# Altium schematic sheet ESP32W_Zzed.SchDoc
size A4
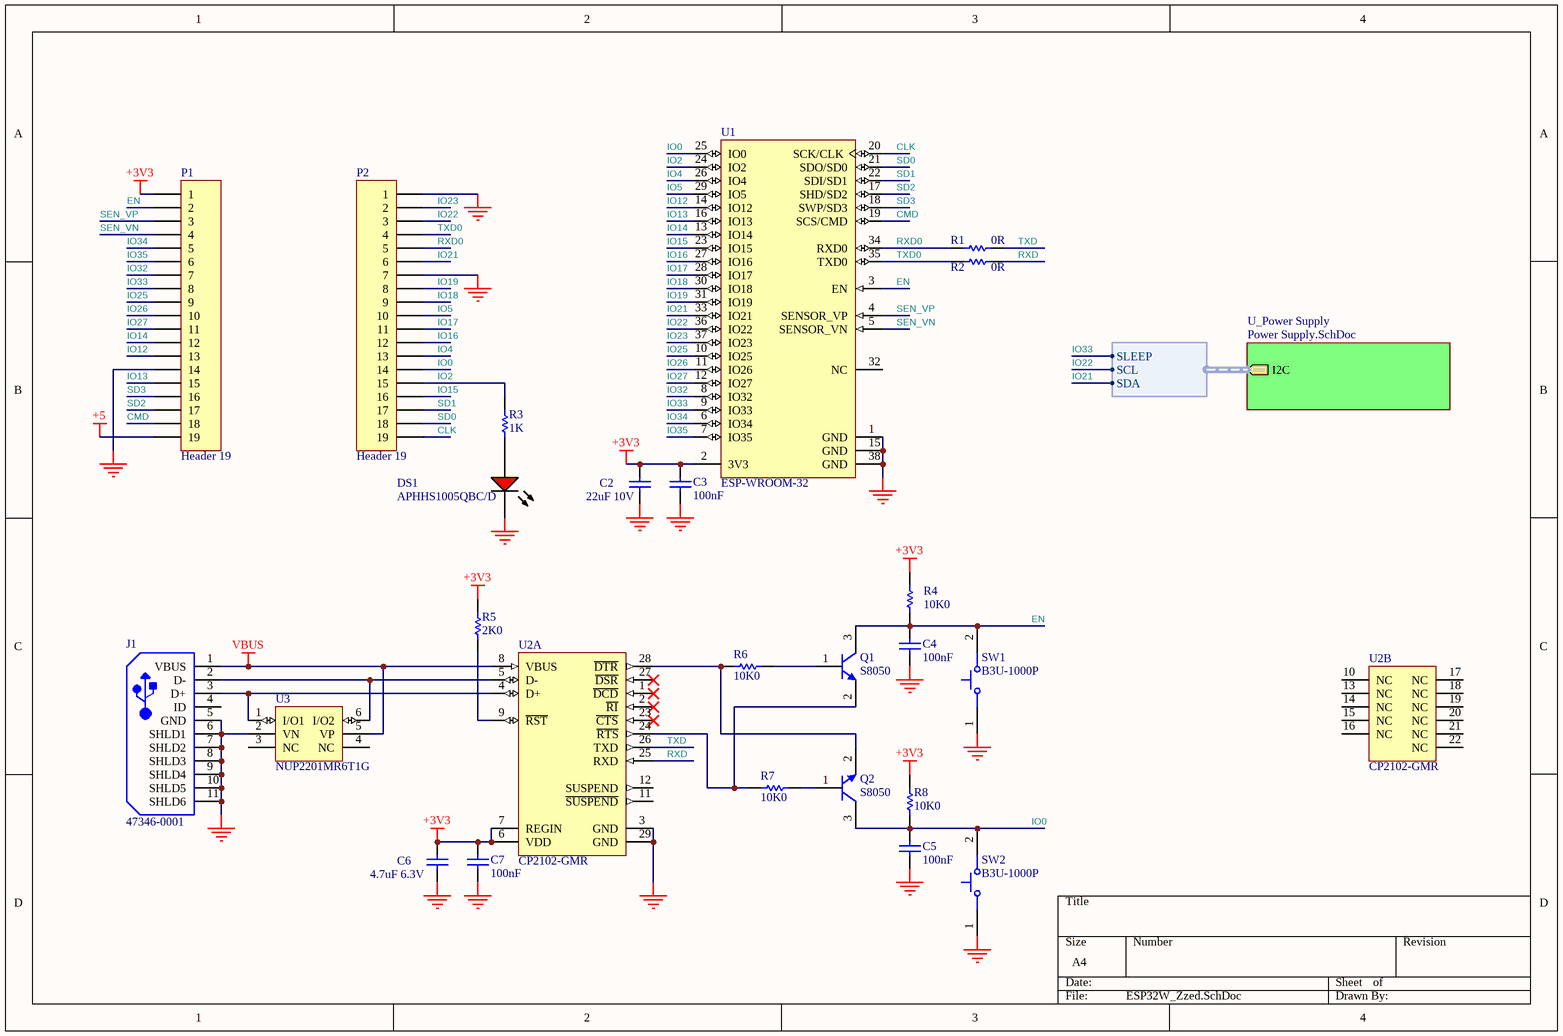
[diagram p0: ESP32W_Zzed.SchDoc]

## Parts
C2  22uF 10V  [CAPC0805(2012)145_L]
C3  100nF  [CAPC0402(1005)60_L]
C4  100nF  [CAPC0402(1005)60_L]
C5  100nF  [CAPC0402(1005)60_L]
C6  4.7uF 6.3V  [CAPC0402(1005)60_L]
C7  100nF  [CAPC0402(1005)60_L]
DS1  APHHS1005QBC/D  [KING-0402_V]
J1  47346-0001  [MOLX-47346-0001-5_V]
P1  Header 19  [HDR1X19]
P2  Header 19  [HDR1X19]
Q1  S8050  [KOCN-SOT23-3_L]
Q2  S8050  [KOCN-SOT23-3_L]
R1  0R  [RESC0402(1005)_L]
R2  0R  [RESC0402(1005)_L]
R3  1K  [RESC0402(1005)_L]
R4  10K0  [RESC0402(1005)_L]
R5  2K0  [RESC0402(1005)_L]
R6  10K0  [RESC0402(1005)_L]
R7  10K0  [RESC0402(1005)_L]
R8  10K0  [RESC0402(1005)_L]
SW1  B3U-1000P  [OMRON-B3U-1000_V]
SW2  B3U-1000P  [OMRON-B3U-1000_V]
U1  ESP-WROOM-32  [OLMX-ESP-WROOM-32]
U2  CP2102-GMR  [SLAB-QFN-28-3125x3125TP_N]  (parts A,B of 2)
U3  NUP2201MR6T1G  [ONSC-TSOP-6_V]

## Sub-sheets
U_Power Supply = Power Supply.SchDoc: I2C (out, harness I2C)

## Harnesses
I2C: SLEEP, SCL, SDA

## Nets
+3V3: C2.2 C3.2 C6.2 C7.2 P1.1 R4.2 R5.2 R8.1 U1.2(3V3) U2.6(VDD) U2.7(REGIN)
+5: P1.19
GND: C2.1 C3.1 C4.1 C5.1 C6.1 C7.1 DS1.2(K) J1.5(GND) J1.6(SHLD1) J1.7(SHLD2) J1.8(SHLD3) J1.9(SHLD4) J1.10(SHLD5) J1.11(SHLD6) P1.14 P2.1 P2.7 SW1.1 SW2.1 U1.1(GND) U1.15(GND) U1.38(GND) U2.3(GND) U2.29(GND) U3.2(VN)
VBUS: J1.1(VBUS) U2.8(VBUS) U3.5(VP)
CLK: P2.19 U1.20(SCK/CLK)
CMD: P1.18 U1.19(SCS/CMD)
EN: C4.2 P1.2 Q1.3(COLLECTOR) R4.1 SW1.2 U1.3(EN)
IO0: C5.2 P2.14 Q2.3(COLLECTOR) R8.2 SW2.2 U1.25(IO0)
IO2: P2.15 R3.2 U1.24(IO2)
IO4: P2.13 U1.26(IO4)
IO5: P2.10 U1.29(IO5)
IO12: P1.13 U1.14(IO12)
IO13: P1.15 U1.16(IO13)
IO14: P1.12 U1.13(IO14)
IO15: P2.16 U1.23(IO15)
IO16: P2.12 U1.27(IO16)
IO17: P2.11 U1.28(IO17)
IO18: P2.9 U1.30(IO18)
IO19: P2.8 U1.31(IO19)
IO21: P2.6 U1.33(IO21) ; sheet U_Power Supply/I2C.SDA
IO22: P2.3 U1.36(IO22) ; sheet U_Power Supply/I2C.SCL
IO23: P2.2 U1.37(IO23)
IO25: P1.9 U1.10(IO25)
IO26: P1.10 U1.11(IO26)
IO27: P1.11 U1.12(IO27)
IO32: P1.7 U1.8(IO32)
IO33: P1.8 U1.9(IO33) ; sheet U_Power Supply/I2C.SLEEP
IO34: P1.5 U1.6(IO34)
IO35: P1.6 U1.7(IO35)
RXD: R2.2 U2.25(RXD)
RXD0: P2.5 R1.1 U1.34(RXD0)
SD0: P2.18 U1.21(SDO/SD0)
SD1: P2.17 U1.22(SDI/SD1)
SD2: P1.17 U1.17(SHD/SD2)
SD3: P1.16 U1.18(SWP/SD3)
SEN_VN: P1.4 U1.5(SENSOR_VN)
SEN_VP: P1.3 U1.4(SENSOR_VP)
TXD: R1.2 U2.26(TXD)
TXD0: P2.4 R2.1 U1.35(TXD0)
NetDS1_1: DS1.1(A) R3.1
NetJ1_2: J1.2(D-) U2.5(D-) U3.6(I/O2)
NetJ1_3: J1.3(D+) U2.4(D+) U3.1(I/O1)
NetQ1_1: Q1.1(BASE) R6.2
NetQ1_2: Q1.2(EMITTER) R7.1 U2.24(~{RTS})
NetQ2_1: Q2.1(BASE) R7.2
NetQ2_2: Q2.2(EMITTER) R6.1 U2.28(~{DTR})
NetR5_1: R5.1 U2.9(~{RST})

Not connected (* = marked no-connect by the designer): J1 4(ID); U1 32(NC); U2 1(~{DCD})* 2(~{RI})* 10(NC) 11(~{SUSPEND}) 12(SUSPEND) 13(NC) 14(NC) 15(NC) 16(NC) 17(NC) 18(NC) 19(NC) 20(NC) 21(NC) 22(NC) 23(~{CTS})* 27(~{DSR})*; U3 3(NC) 4(NC)

## Library data of the parts
C2 = CMP-1036-04942-1: CAP 22uF 10V ±10% 0805 (2012 Metric) Thickness 1.45mm SMD; Case-EIA: 0805; Case-Metric: 2012; Tolerance: Â±10%; Rated Voltage: 10 V; Max Thickness: 1.45 mm; Value: 22uF; Technology: SMT
C3-C5 C7 = CMP-1034-02077-1: CAP 100nF 50V ±10% 0402 (1005 Metric) Thickness 0.6mm SMD; Case-Metric: 1005; Case-EIA: 0402; Tolerance: Â±10%; Value: 100nF; Rated Voltage: 50 V; Technology: SMT; Max Thickness: 0.6 mm
C6 = CMP-1034-02137-1: CAP 4.7uF 6.3V ±20% 0402 (1005 Metric) Thickness 0.6mm SMD; Case-Metric: 1005; Case-EIA: 0402; Tolerance: Â±20%; Technology: SMT; Max Thickness: 0.6 mm; Rated Voltage: 6.3 V; Value: 4.7uF
DS1 = CMP-2000-05787-1: Red Water Clear Chip LED Lamp, 1.95 V, 20 mA, -40 to 85 degC, 2-Pin SMD (0402), RoHS, Tape and Reel; Manufacturer: Kingbright; Lens Style/Size: RectanglewithFlatTop,0.8mmx0.5mm; Wavelength - Dominant: 630nm; 3D Model: APHHS1005x.sldprt / APHHS1005x.pro / APHHS1005x.igs / APHHS1005x.stp; Current - Test: 20mA; Other Names: 754-1104-2; Millicandela Rating: 220mcd; Wavelength - Peak: 650nm; Online Catalog: 0402RectanglewithFlatTopChipLEDs; Viewing Angle: 120°; Voltage - Forward (Vf) (Typ): 1.95V; Catalog Drawings: APHHS1005SeriesSide / APHHS1005SeriesTop; Height: 0.60mm; Datasheet URL: https://datasheet.ciiva.com/4689/aphhs1005surck-32322-4689068.pdf; Datasheet Version: Rev. 8, 08/2010; Color: Red; Standard Package: 2,000; Packaging: Tape&Reel(TR); Manufacturer URL: http://www.kingbright.com/; Size / Dimension: 1.00mmLx0.50mmW; Package Description: 2-Pin Surface Mount Device, Body 1 x 0.5 mm; Package / Case: 0402(1005Metric); Family: LEDIndication-Discrete; Category: Optoelectronics; Lens Type: Clear; Mounting Technology: SurfaceMount; Package Reference: 0402; Mounting Type: SurfaceMount
J1 = CMP-2000-05246-1: Micro-USB B Receptacle with Flange, -30 to 85 degC, 5-Pin SMD, RoHS, Tape and Reel; Manufacturer: Molex; Number of Contacts: 5; Body Orientation: RightAngle; Maximum Voltage Rating: 30VAC; Pitch: 0.65mm; Maximum Current Rating: 1.8/ContactA; Number of Ports: 1; Gender: RCP; Operating Temperature: -30to85C; Part No: 47346-0001; Color: Black; Termination Method: Solder; Contact Plating: GoldOverPalladiumNickelOverNickel; Dimension: 7.8x5.43x2.94mm; Number of Terminals: 5; Datasheet Version: Dec-13; Datasheet URL: https://datasheet.ciiva.com/30075/304740473460001-io-nectors-30075527.pdf; Contact Material: CopperAlloy; RoHS: Yes; Housing Material: LiquidCrystalPolymer; Manufacturer URL: http://www.molex.com/; Packaging: EmbossedTapeandReel; Mounting: SurfaceMount; Type: MicroUSBTypeB
P1 P2 = Header 19: Header, 19-Pin; LatestRevisionDate: 17-Jul-2002; LatestRevisionNote: Re-released for DXP Platform.; Publisher: Altium Limited
Q1 Q2 = CMP-0564-00001-2: NPN Transistor, 0.8 A Collector Current, 3-Pin SOT23, RoHS, Tape and Reel; Manufacturer: Koo Chin; IEBO (max): 0.1 uA; V (BR) EBO (min): 5 V; VCE (sat) (max): 0.6 V; fT(min): 150 MHz; V (BR) CEO (min): 25 V; V (BR) CBO (min): 40 V; VBE (sat) (max): 1.2 V; NPN/PNP: NPN; PackageDescription: 3-Pin Small Out-Line Transistor, Body 1.3 x 2.9 mm, Pitch 0.95 mm; ComponentLink3Description: Package Specification; ComponentLink1Description: Manufacturer URL; RoHS: TRUE; ICEO (max): 0.1 uA; ComponentLink1URL: http://www.hz-dz.net/; PartNumber: S8050; ComponentLink2URL: http://www.hz-dz.net/UploadFiles/2009812164318190.pdf; Packing: Tape and Reel; ComponentLink3URL: http://galaxycn.com/jsp/upload/S8050.pdf; ICBO (max): 0.1 uA; Mounting Technology: Surface Mount; PackageReference: SOT23-3; ComponentLink2Description: Datasheet; DatasheetVersion: 17/08/2009
R1 R2 = CMP-1011-00001-1: Jumper 0402 (1005 Metric); Tolerance: None; Case-Metric: 1005; Case-EIA: 0402; Value: 0.00 Ohm; Power: None; Technology: SMT
R3 = CMP-1011-00510-1: 1K 0.063W 1% 0402 (1005 Metric)  SMD; Case-EIA: 0402; Value: 1000.00 Ohm; Case-Metric: 1005; Technology: SMT; Tolerance: 1 %; Power: 0.063 W
R4 R6-R8 = CMP-1011-00623-1: 10K 0.063W 1% 0402 (1005 Metric)  SMD; Case-Metric: 1005; Value: 10000.00 Ohm; Case-EIA: 0402; Tolerance: 1 %; Technology: SMT; Power: 0.063 W
R5 = CMP-1011-00542-1: 2K 0.063W 1% 0402 (1005 Metric)  SMD; Case-EIA: 0402; Case-Metric: 1005; Value: 2000.00 Ohm; Technology: SMT; Power: 0.063 W; Tolerance: 1 %
SW1 SW2 = CMP-2100-03586-1: Ultra-Small Tactile Switch, 0.05 A, 12 V, -25 to 70 degC, 2-Pin SMD, RoHS, Tape and Reel; Manufacturer: Omron Electronic Components; Operating Force: 1.5N; Current Rating: 50mA; Voltage Rating (DC): 12V; Electrical Life: 200000Cycles; Actuator Length: 0.4mm; Insulation Resistance: 100MOhm; Switch Travel: 0.15mm; Throw Configuration: SPST; Illumination Type: Illuminated; Width: 3mm; Weight: 0.022g; Datasheet Version: 42005.0; Datasheet URL: http://www.omron.com/ecb/products/pdf/en-b3u.pdf; Height: 1.2mm; Package Quantity: 1; REACH SVHC: Unknown; Contact Current Rating: 50mA; Contact Material: Silver; Max Current Rating: 50mA; Package Reference: B3U-1000; Termination: SMD/SMT; Packaging: TapeandReel; Manufacturer URL: http://www.omron.com/; RoHSCompliant: true; Mount: SurfaceMount; Length: 4mm; Min Operating Temperature: -25degC; Depth: 2.5mm; Lead Free: LeadFree; Case/Package: SMD/SMT; Package Description: 2-Pin Surface Mount Device, Body 3 x 2.5 mm; Max Operating Temperature: 70degC; Orientation: Straight
U1 = CMP-2000-07454-1: Espressif System, 2.7 to 3.6 V, -40 to 85 degC, 38-Pin SMD; Manufacturer: Olimex; Package Description: 38-Pin Surface Mount Device, Body 18 x 25.5 mm, Pitch 1.27 mm; Manufacturer URL: https://www.olimex.com; RoHSCompliant: false; Mounting Technology: SurfaceMount; Datasheet Version: Rev. 2.1, 09/2017; Datasheet URL: http://www.espressif.com/sites/default/files/documentation/esp-wroom-32_datasheet_en.pdf; Package Reference: ESP-WROOM-32
U2 = CMP-2000-04924-1: Single-Chip USB to URAT Bridge, 3.3 V, -40 to 85 degC, 28-Pin QFN, RoHS, Tape and Reel; Manufacturer: Silicon Labs; Interface Circuit Standard 1: RS-232; Transmitter and Receiver FIFO Counter: No; Supply Current: 26mA; Operating Supply Voltage (Min): 3V; Operating Supply Voltage (Typ): 3.3V; Data Rate: 1000kbps; Operating Supply Voltage (Max): 3.6V; Number of Channels: 1; Package URL: http://www.silabs.com/Support%20Documents/TechnicalDocs/C8051T61x.pdf; Operating Temperature (Max): 85C; Datasheet URL: http://www.mouser.com/ds/2/368/CP2102-9-247052.pdf; Operating Temperature Classification: Industrial; Operating Temperature (Min): -40C; Package Description: 28-Pin Quad-Flat No-Leads Package, Body 5 x 5 mm, Pitch 0.5 mm; Manufacturer URL: http://www.silabs.com/; Rad Hardened: No; Package Reference: QFN-28; Pin Count: 28; Packaging: TapeandReel; Mounting: SurfaceMount; Package Type: QFNEP; Datasheet Version: Rev. 1.6, 12/2013; PartId: 1
U3 = CMP-0260-00001-1: ESD Protection Diodes with Low Clamping Voltage; Peak Power Dissipation: 500 W; ComponentLink3Description: Package Specification; ComponentLink3URL: http://www.onsemi.com/pub_link/Collateral/318G-02.PDF; PartNumber: NUP2201MR6T1G; Mounting Technology: Surface Mount; ComponentLink1Description: Manufacturer URL; ComponentLink2URL: http://www.onsemi.cn/pub_link/Collateral/NUP2201MR6-D.PDF; PackageDescription: 6-Pin Thin Small Outline, 3 x 1.5 mm Body, 0.95 mm Pitch; ComponentLink2Description: Datasheet; ComponentLink1URL: http://www.onsemi.com/; Storage Temperature: -55 to 125 degC; DatasheetVersion: Rev. 4, 02/2013; PackageReference: TSOP-6; PackageVersion: Rev. V, 6/2012